# Altium project BMS_Slave_R2.PrjPcb
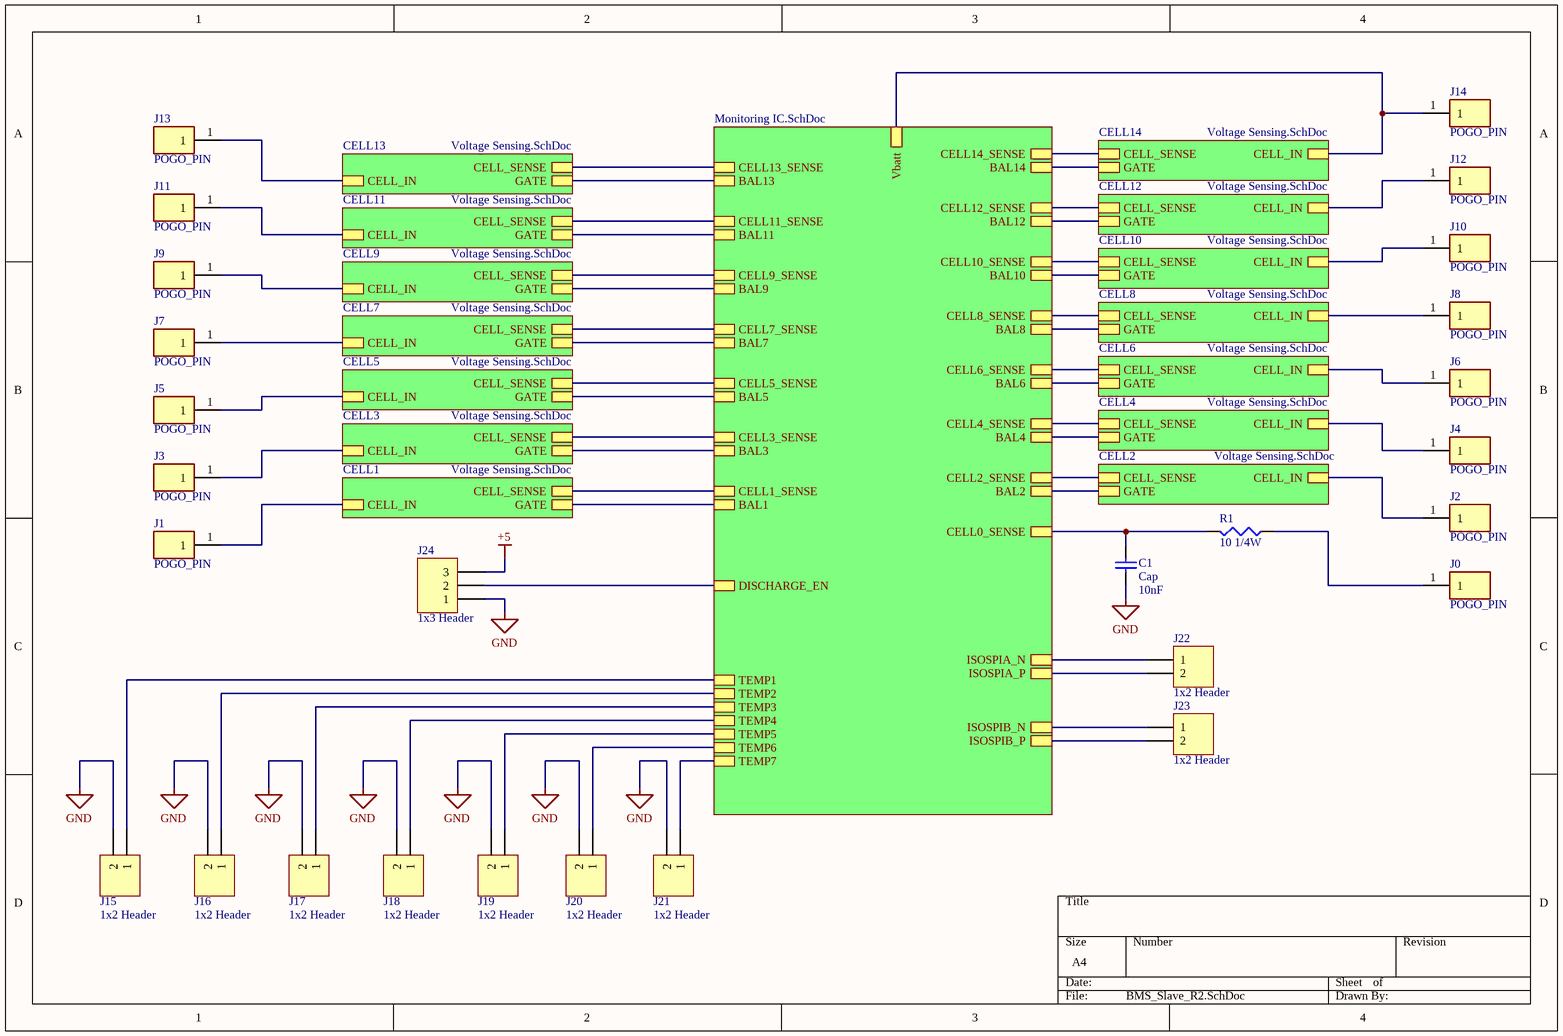
[diagram p0: BMS_Slave_R2.SchDoc]
3 sheets, 120 parts. Net scope: hierarchical (ports join the sheet entries above them; power ports are global).
Board file: BMS_Slave_R2.PcbDoc
Sheets:
  BMS_Slave_R2.SchDoc
    Designator = Monitoring IC.SchDoc
    CELL14 = Voltage Sensing.SchDoc
    CELL12 = Voltage Sensing.SchDoc
    CELL10 = Voltage Sensing.SchDoc
    CELL8 = Voltage Sensing.SchDoc
    CELL6 = Voltage Sensing.SchDoc
    CELL4 = Voltage Sensing.SchDoc
    CELL2 = Voltage Sensing.SchDoc
    CELL13 = Voltage Sensing.SchDoc
    CELL11 = Voltage Sensing.SchDoc
    CELL9 = Voltage Sensing.SchDoc
    CELL7 = Voltage Sensing.SchDoc
    CELL5 = Voltage Sensing.SchDoc
    CELL3 = Voltage Sensing.SchDoc
    CELL1 = Voltage Sensing.SchDoc

## Sheet BMS_Slave_R2.SchDoc
size A4

### Parts
C1  Cap  value 10nF  [0603 - Capacitor]
J0  POGO_PIN  [POGO_PIN]
J1  POGO_PIN  [POGO_PIN]
J2  POGO_PIN  [POGO_PIN]
J3  POGO_PIN  [POGO_PIN]
J4  POGO_PIN  [POGO_PIN]
J5  POGO_PIN  [POGO_PIN]
J6  POGO_PIN  [POGO_PIN]
J7  POGO_PIN  [POGO_PIN]
J8  POGO_PIN  [POGO_PIN]
J9  POGO_PIN  [POGO_PIN]
J10  POGO_PIN  [POGO_PIN]
J11  POGO_PIN  [POGO_PIN]
J12  POGO_PIN  [POGO_PIN]
J13  POGO_PIN  [POGO_PIN]
J14  POGO_PIN  [POGO_PIN]
J15  1x2 Header  [HDR1X2]
J16  1x2 Header  [HDR1X2]
J17  1x2 Header  [HDR1X2]
J18  1x2 Header  [HDR1X2]
J19  1x2 Header  [HDR1X2]
J20  1x2 Header  [HDR1X2]
J21  1x2 Header  [HDR1X2]
J22  1x2 Header  [B2BXH2LFSN]
J23  1x2 Header  [B2BXH2LFSN]
J24  1x3 Header  [HDR1X3]
R1  value 10 1/4W  [0805 - Resistor]  (hidden comment: Res3)

### Sub-sheets
CELL1 = Voltage Sensing.SchDoc: CELL_SENSE, CELL_IN, GATE
CELL2 = Voltage Sensing.SchDoc: CELL_SENSE, CELL_IN, GATE
CELL3 = Voltage Sensing.SchDoc: CELL_SENSE, CELL_IN, GATE
CELL4 = Voltage Sensing.SchDoc: CELL_SENSE, CELL_IN, GATE
CELL5 = Voltage Sensing.SchDoc: CELL_SENSE, CELL_IN, GATE
CELL6 = Voltage Sensing.SchDoc: CELL_SENSE, CELL_IN, GATE
CELL7 = Voltage Sensing.SchDoc: CELL_SENSE, CELL_IN, GATE
CELL8 = Voltage Sensing.SchDoc: CELL_SENSE, CELL_IN, GATE
CELL9 = Voltage Sensing.SchDoc: CELL_SENSE, CELL_IN, GATE
CELL10 = Voltage Sensing.SchDoc: CELL_SENSE, CELL_IN, GATE
CELL11 = Voltage Sensing.SchDoc: CELL_SENSE, CELL_IN, GATE
CELL12 = Voltage Sensing.SchDoc: CELL_SENSE, CELL_IN, GATE
CELL13 = Voltage Sensing.SchDoc: CELL_SENSE, CELL_IN, GATE
CELL14 = Voltage Sensing.SchDoc: CELL_SENSE, CELL_IN, GATE
Designator = Monitoring IC.SchDoc: CELL14_SENSE, BAL14, CELL13_SENSE, BAL13, CELL12_SENSE, BAL12, CELL11_SENSE, BAL11, CELL10_SENSE, BAL10, CELL9_SENSE, BAL9, CELL8_SENSE, BAL8, CELL7_SENSE, BAL7, CELL6_SENSE, BAL6, CELL5_SENSE, BAL5, CELL4_SENSE, BAL4, CELL3_SENSE, BAL3, BAL2, CELL2_SENSE, CELL1_SENSE, BAL1, TEMP3, TEMP4, TEMP2, TEMP1, TEMP5, CELL0_SENSE, DISCHARGE_EN, ISOSPIA_N, ISOSPIB_P, ISOSPIB_N, ISOSPIA_P, Vbatt, TEMP6, TEMP7

### Nets
+5: J24.3
GND: C1.1 J15.2 J16.2 J17.2 J18.2 J19.2 J20.2 J21.2 J24.1
ISOSPIA_N: J22.1 ; sheet Designator/ISOSPIA_N
ISOSPIA_P: J22.2 ; sheet Designator/ISOSPIA_P
ISOSPIB_N: J23.1 ; sheet Designator/ISOSPIB_N
ISOSPIB_P: J23.2 ; sheet Designator/ISOSPIB_P
NetC1_2: C1.2 R1.1 ; sheet Designator/CELL0_SENSE
NetC5#2_2: sheet Designator/CELL14_SENSE, sheet CELL14/CELL_SENSE
NetC5#3_2: sheet Designator/CELL12_SENSE, sheet CELL12/CELL_SENSE
NetC5#4_2: sheet Designator/CELL10_SENSE, sheet CELL10/CELL_SENSE
NetC5#5_2: sheet Designator/CELL8_SENSE, sheet CELL8/CELL_SENSE
NetC5#6_2: sheet Designator/CELL6_SENSE, sheet CELL6/CELL_SENSE
NetC5#7_2: sheet Designator/CELL4_SENSE, sheet CELL4/CELL_SENSE
NetC5#8_2: sheet Designator/CELL2_SENSE, sheet CELL2/CELL_SENSE
NetC5#9_2: sheet Designator/CELL13_SENSE, sheet CELL13/CELL_SENSE
NetC5#10_2: sheet Designator/CELL11_SENSE, sheet CELL11/CELL_SENSE
NetC5#11_2: sheet Designator/CELL9_SENSE, sheet CELL9/CELL_SENSE
NetC5#12_2: sheet Designator/CELL7_SENSE, sheet CELL7/CELL_SENSE
NetC5#13_2: sheet Designator/CELL5_SENSE, sheet CELL5/CELL_SENSE
NetC5#14_2: sheet Designator/CELL3_SENSE, sheet CELL3/CELL_SENSE
NetC5#15_2: sheet Designator/CELL1_SENSE, sheet CELL1/CELL_SENSE
NetD2#1_2: sheet Designator/BAL14, sheet CELL14/GATE
NetD2#2_2: sheet Designator/BAL12, sheet CELL12/GATE
NetD2#3_2: sheet Designator/BAL10, sheet CELL10/GATE
NetD2#4_2: sheet Designator/BAL8, sheet CELL8/GATE
NetD2#5_2: sheet Designator/BAL6, sheet CELL6/GATE
NetD2#6_2: sheet Designator/BAL4, sheet CELL4/GATE
NetD2#7_2: sheet Designator/BAL2, sheet CELL2/GATE
NetD2#8_2: sheet Designator/BAL13, sheet CELL13/GATE
NetD2#9_2: sheet Designator/BAL11, sheet CELL11/GATE
NetD2#10_2: sheet Designator/BAL9, sheet CELL9/GATE
NetD2#11_2: sheet Designator/BAL7, sheet CELL7/GATE
NetD2#12_2: sheet Designator/BAL5, sheet CELL5/GATE
NetD2#13_2: sheet Designator/BAL3, sheet CELL3/GATE
NetD2#14_2: sheet Designator/BAL1, sheet CELL1/GATE
NetJ0_1: J0.1 R1.2
NetJ1_1: J1.1 ; sheet CELL1/CELL_IN
NetJ2_1: J2.1 ; sheet CELL2/CELL_IN
NetJ3_1: J3.1 ; sheet CELL3/CELL_IN
NetJ4_1: J4.1 ; sheet CELL4/CELL_IN
NetJ5_1: J5.1 ; sheet CELL5/CELL_IN
NetJ6_1: J6.1 ; sheet CELL6/CELL_IN
NetJ7_1: J7.1 ; sheet CELL7/CELL_IN
NetJ8_1: J8.1 ; sheet CELL8/CELL_IN
NetJ9_1: J9.1 ; sheet CELL9/CELL_IN
NetJ10_1: J10.1 ; sheet CELL10/CELL_IN
NetJ11_1: J11.1 ; sheet CELL11/CELL_IN
NetJ12_1: J12.1 ; sheet CELL12/CELL_IN
NetJ13_1: J13.1 ; sheet CELL13/CELL_IN
NetJ14_1: J14.1 ; sheet Designator/Vbatt, sheet CELL14/CELL_IN
NetJ15_1: J15.1 ; sheet Designator/TEMP1
NetJ16_1: J16.1 ; sheet Designator/TEMP2
NetJ17_1: J17.1 ; sheet Designator/TEMP3
NetJ18_1: J18.1 ; sheet Designator/TEMP4
NetJ19_1: J19.1 ; sheet Designator/TEMP5
NetJ20_1: J20.1 ; sheet Designator/TEMP6
NetJ21_1: J21.1 ; sheet Designator/TEMP7
NetJ24_2: J24.2 ; sheet Designator/DISCHARGE_EN

### Library data of the parts
C1 = Cap: Capacitor; Published: 8-Jun-2000; LatestRevisionDate: 17-Jul-2002; LatestRevisionNote: Re-released for DXP Platform.; PackageReference: RAD-0.3; Publisher: Altium Limited; PackageDescription: Radial Cap, Thru-Hole; 2 Leads; 0.3 in Pin Spacing
J0-J14 = POGO_PIN: Pogo Pin
J15-J23 = 1x2 Header: 1x2 Pin Header
J24 = 1x3 Header: 1x3 Pin Header
R1 = Res3: Resistor; Published: 8-Jun-2000; LatestRevisionDate: 29-May-2009; LatestRevisionNote: IPC-7351 Footprint Added.; PackageReference: J1-0603; Publisher: Altium Limited; PackageDescription: Chip Resistor

## Sheet Monitoring IC.SchDoc
size A4
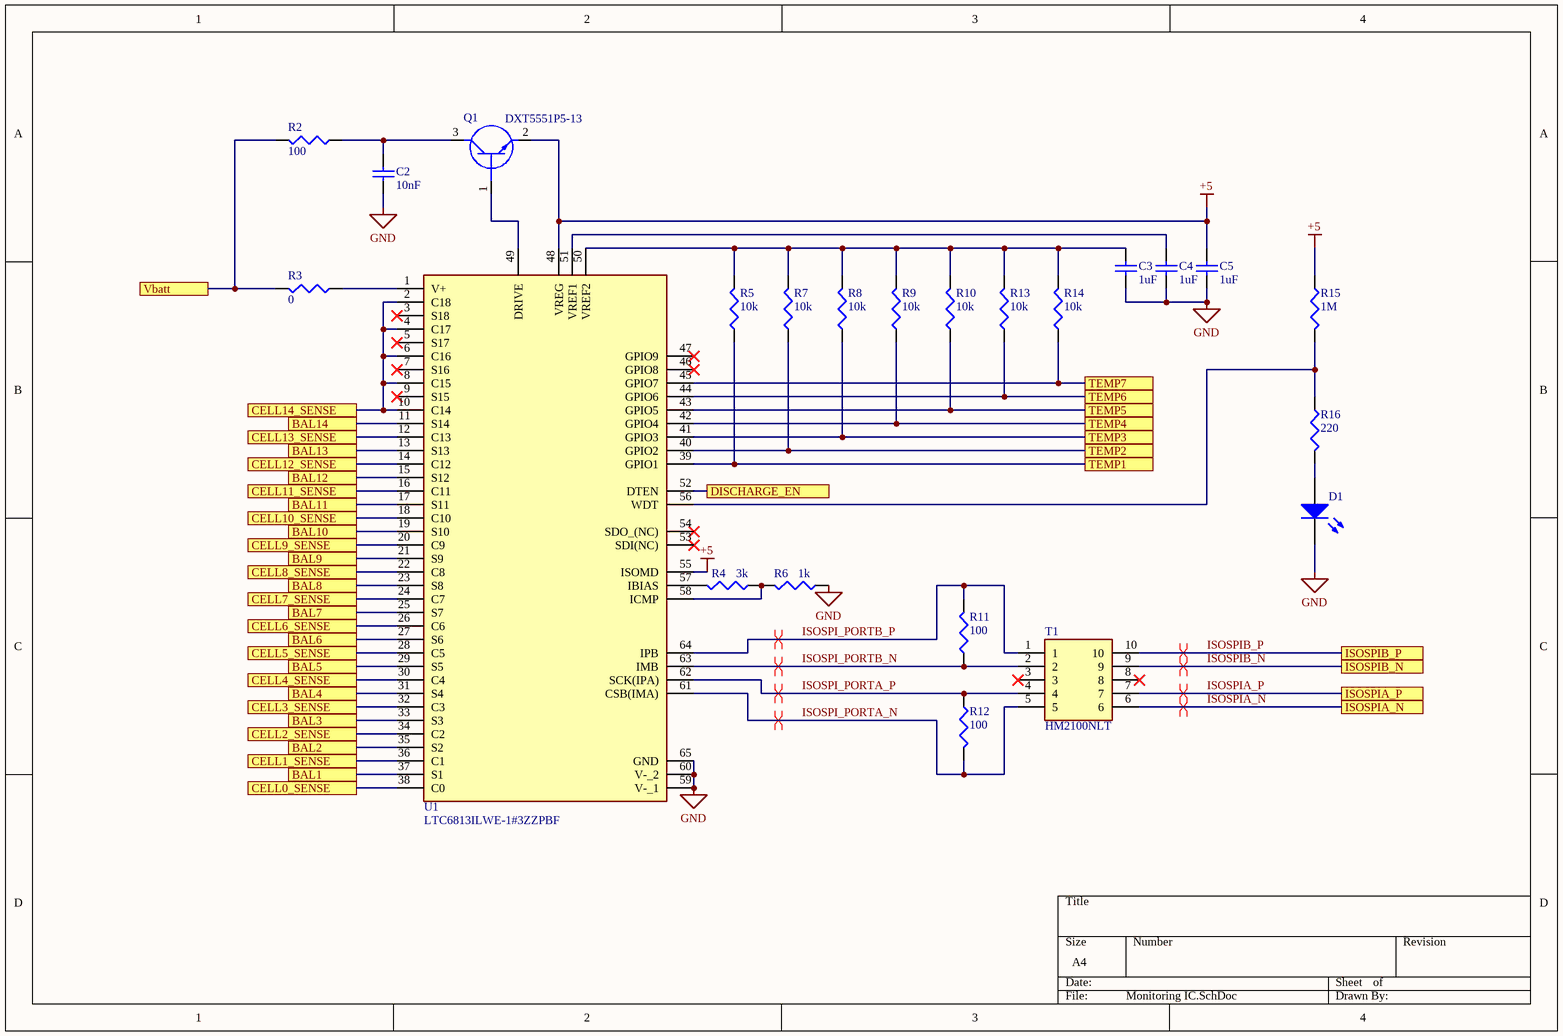
[diagram p1: Monitoring IC.SchDoc]

### Parts
(Parts that share a designator on the sheet are numbered #1, #2 ... from top to bottom, then left to right.)
C2  value 10nF  [0603 - Capacitor]  (hidden comment: Cap)
C3  value 1uF  [0603 - Capacitor]  (hidden comment: Cap)
C4  value 1uF  [0603 - Capacitor]  (hidden comment: Cap)
C5#1  value 1uF  [0603 - Capacitor]  (hidden comment: Cap)
D1  LED2  [DIOC1608X06N]  (value not drawn)
Q1  DXT5551P5-13  [DXT5551P513]
R2  value 100  [0603 - Resistor]  (hidden comment: Res3)
R3  value 0  [0603 - Resistor]  (hidden comment: Res3)
R4  value 3k  [0603 - Resistor]  (hidden comment: Res3)
R5  value 10k  [0603 - Resistor]  (hidden comment: Res3)
R6  value 1k  [0603 - Resistor]  (hidden comment: Res3)
R7  value 10k  [0603 - Resistor]  (hidden comment: Res3)
R8  value 10k  [0603 - Resistor]  (hidden comment: Res3)
R9  value 10k  [0603 - Resistor]  (hidden comment: Res3)
R10  value 10k  [0603 - Resistor]  (hidden comment: Res3)
R11  value 100  [0603 - Resistor]  (hidden comment: Res3)
R12  value 100  [0603 - Resistor]  (hidden comment: Res3)
R13  value 10k  [0603 - Resistor]  (hidden comment: Res3)
R14  value 10k  [0603 - Resistor]  (hidden comment: Res3)
R15#1  value 1M  [0603 - Resistor]  (hidden comment: Res3)
R16#1  value 220  [0603 - Resistor]  (hidden comment: Res3)
T1  HM2100NLT  [HM2100NLT]
U1  LTC6813ILWE-1#3ZZPBF  [QFP50P1200X1200X120-65N]

### Ports
BAL1, BAL2, BAL3, BAL4, BAL5, BAL6, BAL7, BAL8, BAL9, BAL10, BAL11, BAL12, BAL13, BAL14, CELL0_SENSE, CELL1_SENSE, CELL2_SENSE, CELL3_SENSE, CELL4_SENSE, CELL5_SENSE, CELL6_SENSE, CELL7_SENSE, CELL8_SENSE, CELL9_SENSE, CELL10_SENSE, CELL11_SENSE, CELL12_SENSE, CELL13_SENSE, CELL14_SENSE, DISCHARGE_EN, ISOSPIA_N, ISOSPIA_P, ISOSPIB_N, ISOSPIB_P, TEMP1, TEMP2, TEMP3, TEMP4, TEMP5, TEMP6, TEMP7, Vbatt

### Nets
+5: C5#1.2 Q1.2(E) R15#1.1 U1.48(VREG) U1.55(ISOMD)
GND: C2.1 C3.1 C4.1 C5#1.1 D1.2(K) R6.1 U1.59(V-_1) U1.60(V-_2) U1.65(GND)
ISOSPI_PORTA_N: R12.2 T1.5 U1.61(CSB(IMA))
ISOSPI_PORTA_P: R12.1 T1.4 U1.62(SCK(IPA))
ISOSPI_PORTB_N: R11.1 T1.2 U1.63(IMB)
ISOSPI_PORTB_P: R11.2 T1.1 U1.64(IPB)
ISOSPIA_N: T1.6 ; port ISOSPIA_N
ISOSPIA_P: T1.7 ; port ISOSPIA_P
ISOSPIB_N: T1.9 ; port ISOSPIB_N
ISOSPIB_P: T1.10 ; port ISOSPIB_P
NetC1_2: U1.38(C0) ; port CELL0_SENSE
NetC2_2: C2.2 Q1.3(C) R2.2
NetC3_2: C3.2 R5.2 R7.2 R8.2 R9.2 R10.2 R13.2 R14.2 U1.50(VREF2)
NetC4_2: C4.2 U1.51(VREF1)
NetC5#2_2: U1.2(C18) U1.4(C17) U1.6(C16) U1.8(C15) U1.10(C14) ; port CELL14_SENSE
NetC5#3_2: U1.14(C12) ; port CELL12_SENSE
NetC5#4_2: U1.18(C10) ; port CELL10_SENSE
NetC5#5_2: U1.22(C8) ; port CELL8_SENSE
NetC5#6_2: U1.26(C6) ; port CELL6_SENSE
NetC5#7_2: U1.30(C4) ; port CELL4_SENSE
NetC5#8_2: U1.34(C2) ; port CELL2_SENSE
NetC5#9_2: U1.12(C13) ; port CELL13_SENSE
NetC5#10_2: U1.16(C11) ; port CELL11_SENSE
NetC5#11_2: U1.20(C9) ; port CELL9_SENSE
NetC5#12_2: U1.24(C7) ; port CELL7_SENSE
NetC5#13_2: U1.28(C5) ; port CELL5_SENSE
NetC5#14_2: U1.32(C3) ; port CELL3_SENSE
NetC5#15_2: U1.36(C1) ; port CELL1_SENSE
NetD1_1: D1.1(A) R16#1.2
NetD2#1_2: U1.11(S14) ; port BAL14
NetD2#2_2: U1.15(S12) ; port BAL12
NetD2#3_2: U1.19(S10) ; port BAL10
NetD2#4_2: U1.23(S8) ; port BAL8
NetD2#5_2: U1.27(S6) ; port BAL6
NetD2#6_2: U1.31(S4) ; port BAL4
NetD2#7_2: U1.35(S2) ; port BAL2
NetD2#8_2: U1.13(S13) ; port BAL13
NetD2#9_2: U1.17(S11) ; port BAL11
NetD2#10_2: U1.21(S9) ; port BAL9
NetD2#11_2: U1.25(S7) ; port BAL7
NetD2#12_2: U1.29(S5) ; port BAL5
NetD2#13_2: U1.33(S3) ; port BAL3
NetD2#14_2: U1.37(S1) ; port BAL1
NetJ14_1: R2.1 R3.1 ; port Vbatt
NetJ15_1: R5.1 U1.39(GPIO1) ; port TEMP1
NetJ16_1: R7.1 U1.40(GPIO2) ; port TEMP2
NetJ17_1: R8.1 U1.41(GPIO3) ; port TEMP3
NetJ18_1: R9.1 U1.42(GPIO4) ; port TEMP4
NetJ19_1: R10.1 U1.43(GPIO5) ; port TEMP5
NetJ20_1: R13.1 U1.44(GPIO6) ; port TEMP6
NetJ21_1: R14.1 U1.45(GPIO7) ; port TEMP7
NetJ24_2: U1.52(DTEN) ; port DISCHARGE_EN
NetQ1_1: Q1.1(B) U1.49(DRIVE)
NetR3_2: R3.2 U1.1(V+)
NetR4_1: R4.1 R6.2 U1.58(ICMP)
NetR4_2: R4.2 U1.57(IBIAS)
NetR15#1_2: R15#1.2 R16#1.1 U1.56(WDT)

Not connected (* = marked no-connect by the designer): T1 3* 8*; U1 3(S18)* 5(S17)* 7(S16)* 9(S15)* 46(GPIO8)* 47(GPIO9)* 53(SDI(NC))* 54(SDO_(NC))*

### Layout directives
differential pair: ISOSPI_PORTA_N
differential pair; differential pair class ISOSPI_PORTA_N: ISOSPI_PORTA_P, ISOSPI_PORTB_N, ISOSPI_PORTB_P, ISOSPIA_N, ISOSPIA_P, ISOSPIB_N, ISOSPIB_P

### Library data of the parts
C2-C4 C5#1 = Cap: Capacitor; Published: 8-Jun-2000; LatestRevisionDate: 17-Jul-2002; LatestRevisionNote: Re-released for DXP Platform.; PackageReference: RAD-0.3; Publisher: Altium Limited; PackageDescription: Radial Cap, Thru-Hole; 2 Leads; 0.3 in Pin Spacing
D1 = LED2: Typical RED, GREEN, YELLOW, AMBER GaAs LED; Published: 8-Jun-2000; LatestRevisionDate: 17-Jul-2002; LatestRevisionNote: Re-released for DXP Platform.; PackageVersion: Feb-2002; PackageReference: 3.2X1.6X1.1; Publisher: Altium Limited; PackageDescription: SM LED; 2 Flat Leads
Q1 = DXT5551P5-13: Transistor BJT NPN; Manufacturer_Name: Diodes Inc.; Datasheet Link: https://www.diodes.com/assets/Datasheets/DXT5551P5.pdf; Manufacturer_Part_Number: DXT5551P5-13; Mouser Part Number: 522-DXT5551P5-13; Mouser Price/Stock: https://www.mouser.com/Search/Refine.aspx?Keyword=522-DXT5551P5-13
R2-R14 R15#1 R16#1 = Res3: Resistor; Published: 8-Jun-2000; LatestRevisionDate: 29-May-2009; LatestRevisionNote: IPC-7351 Footprint Added.; PackageReference: J1-0603; Publisher: Altium Limited; PackageDescription: Chip Resistor
T1 = HM2100NLT: Transformer; Manufacturer_Name: Pulse; Datasheet Link: https://productfinder.pulseeng.com/doc_type/WEB301/doc_num/HM2100NL/doc_part/HM2100NL.pdf; Height: 3.45mm; Manufacturer_Part_Number: HM2100NLT; Mouser Part Number: 673-HM2100NLT; Mouser Price/Stock: https://www.mouser.com/Search/Refine.aspx?Keyword=673-HM2100NLT
U1 = LTC6813ILWE-1#3ZZPBF: Integrated Circuit; Manufacturer_Name: Analog Devices; Datasheet Link: https://www.analog.com/media/en/technical-documentation/data-sheets/68131f.pdf; Height: 1.6mm; Manufacturer_Part_Number: LTC6813ILWE-1#3ZZPBF; Mouser Part Number: 584-6813ILWE13ZZPBF

## Sheet Voltage Sensing.SchDoc
size A4
Used 14 times, as channels CELL14, CELL12, CELL10, CELL8, CELL6, CELL4, CELL2, CELL13, CELL11, CELL9, CELL7, CELL5, CELL3, CELL1. Parts and nets are listed once, with the designators drawn on the sheet.
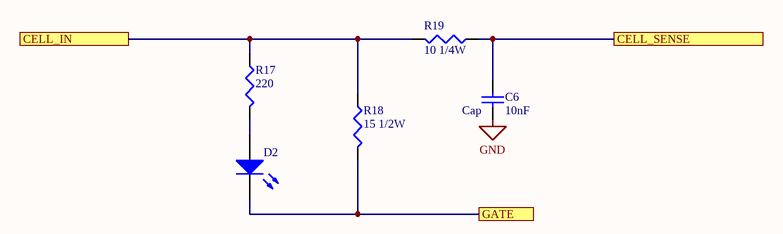
[diagram p2: Voltage Sensing.SchDoc]

### Parts
C6  Cap  value 10nF  [0603 - Capacitor]
D2  LED2  [DIOC1608X06N]  (value not drawn)
R17  value 220  [0805 - Resistor]  (hidden comment: Res3)
R18  value 15 1/2W  [14-1210]  (hidden comment: Res3)
R19  value 10 1/4W  [0805 - Resistor]  (hidden comment: Res3)

### Ports
CELL_IN, CELL_SENSE, GATE

### Nets
GND: C6.1
CELL_IN: R17.1 R18.1 R19.2 ; port CELL_IN
CELL_SENSE: C6.2 R19.1 ; port CELL_SENSE
GATE: D2.2(K) R18.2 ; port GATE
NetD2_1: D2.1(A) R17.2

### Channels
CELL14: designators C6=C5#2 D2=D2#1 R17=R15#2 R18=R16#2 R19=R17#1; ports CELL_IN=NetJ14_1 CELL_SENSE=NetC5#2_2 GATE=NetD2#1_2
CELL12: designators C6=C5#3 D2=D2#2 R17=R15#3 R18=R16#3 R19=R17#2; ports CELL_IN=NetJ12_1 CELL_SENSE=NetC5#3_2 GATE=NetD2#2_2
CELL10: designators C6=C5#4 D2=D2#3 R17=R15#4 R18=R16#4 R19=R17#3; ports CELL_IN=NetJ10_1 CELL_SENSE=NetC5#4_2 GATE=NetD2#3_2
CELL8: designators C6=C5#5 D2=D2#4 R17=R15#5 R18=R16#5 R19=R17#4; ports CELL_IN=NetJ8_1 CELL_SENSE=NetC5#5_2 GATE=NetD2#4_2
CELL6: designators C6=C5#6 D2=D2#5 R17=R15#6 R18=R16#6 R19=R17#5; ports CELL_IN=NetJ6_1 CELL_SENSE=NetC5#6_2 GATE=NetD2#5_2
CELL4: designators C6=C5#7 D2=D2#6 R17=R15#7 R18=R16#7 R19=R17#6; ports CELL_IN=NetJ4_1 CELL_SENSE=NetC5#7_2 GATE=NetD2#6_2
CELL2: designators C6=C5#8 D2=D2#7 R17=R15#8 R18=R16#8 R19=R17#7; ports CELL_IN=NetJ2_1 CELL_SENSE=NetC5#8_2 GATE=NetD2#7_2
CELL13: designators C6=C5#9 D2=D2#8 R17=R15#9 R18=R16#9 R19=R17#8; ports CELL_IN=NetJ13_1 CELL_SENSE=NetC5#9_2 GATE=NetD2#8_2
CELL11: designators C6=C5#10 D2=D2#9 R17=R15#10 R18=R16#10 R19=R17#9; ports CELL_IN=NetJ11_1 CELL_SENSE=NetC5#10_2 GATE=NetD2#9_2
CELL9: designators C6=C5#11 D2=D2#10 R17=R15#11 R18=R16#11 R19=R17#10; ports CELL_IN=NetJ9_1 CELL_SENSE=NetC5#11_2 GATE=NetD2#10_2
CELL7: designators C6=C5#12 D2=D2#11 R17=R15#12 R18=R16#12 R19=R17#11; ports CELL_IN=NetJ7_1 CELL_SENSE=NetC5#12_2 GATE=NetD2#11_2
CELL5: designators C6=C5#13 D2=D2#12 R17=R15#13 R18=R16#13 R19=R17#12; ports CELL_IN=NetJ5_1 CELL_SENSE=NetC5#13_2 GATE=NetD2#12_2
CELL3: designators C6=C5#14 D2=D2#13 R17=R15#14 R18=R16#14 R19=R17#13; ports CELL_IN=NetJ3_1 CELL_SENSE=NetC5#14_2 GATE=NetD2#13_2
CELL1: designators C6=C5#15 D2=D2#14 R17=R15#15 R18=R16#15 R19=R17#14; ports CELL_IN=NetJ1_1 CELL_SENSE=NetC5#15_2 GATE=NetD2#14_2

### Library data of the parts
C6 = Cap: Capacitor; Published: 8-Jun-2000; LatestRevisionDate: 17-Jul-2002; LatestRevisionNote: Re-released for DXP Platform.; PackageReference: RAD-0.3; Publisher: Altium Limited; PackageDescription: Radial Cap, Thru-Hole; 2 Leads; 0.3 in Pin Spacing
D2 = LED2: as D1 on sheet Monitoring IC; Published: 8-Jun-2000; LatestRevisionDate: 17-Jul-2002; LatestRevisionNote: Re-released for DXP Platform.; PackageVersion: Feb-2002; PackageReference: 3.2X1.6X1.1; Publisher: Altium Limited; PackageDescription: SM LED; 2 Flat Leads
R17-R19 = Res3: Resistor; Published: 8-Jun-2000; LatestRevisionDate: 29-May-2009; LatestRevisionNote: IPC-7351 Footprint Added.; PackageReference: J1-0603; Publisher: Altium Limited; PackageDescription: Chip Resistor

## Nets that join several sheets
+5: BMS_Slave_R2 (J24.3), Monitoring IC (5 pins)
GND: BMS_Slave_R2 (9 pins), Monitoring IC (9 pins), CELL14 (C5#2.1), CELL12 (C5#3.1), CELL10 (C5#4.1), CELL8 (C5#5.1), CELL6 (C5#6.1), CELL4 (C5#7.1), CELL2 (C5#8.1), CELL13 (C5#9.1), CELL11 (C5#10.1), CELL9 (C5#11.1), CELL7 (C5#12.1), CELL5 (C5#13.1), CELL3 (C5#14.1), CELL1 (C5#15.1)
ISOSPIA_N: BMS_Slave_R2 (J22.1), Monitoring IC (T1.6)
ISOSPIA_P: BMS_Slave_R2 (J22.2), Monitoring IC (T1.7)
ISOSPIB_N: BMS_Slave_R2 (J23.1), Monitoring IC (T1.9)
ISOSPIB_P: BMS_Slave_R2 (J23.2), Monitoring IC (T1.10)
NetC1_2: BMS_Slave_R2 (C1.2 R1.1), Monitoring IC (U1.38)
NetC5#2_2: Monitoring IC (5 pins), CELL14 (C5#2.2 R17#1.1)
NetC5#3_2: Monitoring IC (U1.14), CELL12 (C5#3.2 R17#2.1)
NetC5#4_2: Monitoring IC (U1.18), CELL10 (C5#4.2 R17#3.1)
NetC5#5_2: Monitoring IC (U1.22), CELL8 (C5#5.2 R17#4.1)
NetC5#6_2: Monitoring IC (U1.26), CELL6 (C5#6.2 R17#5.1)
NetC5#7_2: Monitoring IC (U1.30), CELL4 (C5#7.2 R17#6.1)
NetC5#8_2: Monitoring IC (U1.34), CELL2 (C5#8.2 R17#7.1)
NetC5#9_2: Monitoring IC (U1.12), CELL13 (C5#9.2 R17#8.1)
NetC5#10_2: Monitoring IC (U1.16), CELL11 (C5#10.2 R17#9.1)
NetC5#11_2: Monitoring IC (U1.20), CELL9 (C5#11.2 R17#10.1)
NetC5#12_2: Monitoring IC (U1.24), CELL7 (C5#12.2 R17#11.1)
NetC5#13_2: Monitoring IC (U1.28), CELL5 (C5#13.2 R17#12.1)
NetC5#14_2: Monitoring IC (U1.32), CELL3 (C5#14.2 R17#13.1)
NetC5#15_2: Monitoring IC (U1.36), CELL1 (C5#15.2 R17#14.1)
NetD2#1_2: Monitoring IC (U1.11), CELL14 (D2#1.2 R16#2.2)
NetD2#2_2: Monitoring IC (U1.15), CELL12 (D2#2.2 R16#3.2)
NetD2#3_2: Monitoring IC (U1.19), CELL10 (D2#3.2 R16#4.2)
NetD2#4_2: Monitoring IC (U1.23), CELL8 (D2#4.2 R16#5.2)
NetD2#5_2: Monitoring IC (U1.27), CELL6 (D2#5.2 R16#6.2)
NetD2#6_2: Monitoring IC (U1.31), CELL4 (D2#6.2 R16#7.2)
NetD2#7_2: Monitoring IC (U1.35), CELL2 (D2#7.2 R16#8.2)
NetD2#8_2: Monitoring IC (U1.13), CELL13 (D2#8.2 R16#9.2)
NetD2#9_2: Monitoring IC (U1.17), CELL11 (D2#9.2 R16#10.2)
NetD2#10_2: Monitoring IC (U1.21), CELL9 (D2#10.2 R16#11.2)
NetD2#11_2: Monitoring IC (U1.25), CELL7 (D2#11.2 R16#12.2)
NetD2#12_2: Monitoring IC (U1.29), CELL5 (D2#12.2 R16#13.2)
NetD2#13_2: Monitoring IC (U1.33), CELL3 (D2#13.2 R16#14.2)
NetD2#14_2: Monitoring IC (U1.37), CELL1 (D2#14.2 R16#15.2)
NetJ1_1: BMS_Slave_R2 (J1.1), CELL1 (R15#15.1 R16#15.1 R17#14.2)
NetJ2_1: BMS_Slave_R2 (J2.1), CELL2 (R15#8.1 R16#8.1 R17#7.2)
NetJ3_1: BMS_Slave_R2 (J3.1), CELL3 (R15#14.1 R16#14.1 R17#13.2)
NetJ4_1: BMS_Slave_R2 (J4.1), CELL4 (R15#7.1 R16#7.1 R17#6.2)
NetJ5_1: BMS_Slave_R2 (J5.1), CELL5 (R15#13.1 R16#13.1 R17#12.2)
NetJ6_1: BMS_Slave_R2 (J6.1), CELL6 (R15#6.1 R16#6.1 R17#5.2)
NetJ7_1: BMS_Slave_R2 (J7.1), CELL7 (R15#12.1 R16#12.1 R17#11.2)
NetJ8_1: BMS_Slave_R2 (J8.1), CELL8 (R15#5.1 R16#5.1 R17#4.2)
NetJ9_1: BMS_Slave_R2 (J9.1), CELL9 (R15#11.1 R16#11.1 R17#10.2)
NetJ10_1: BMS_Slave_R2 (J10.1), CELL10 (R15#4.1 R16#4.1 R17#3.2)
NetJ11_1: BMS_Slave_R2 (J11.1), CELL11 (R15#10.1 R16#10.1 R17#9.2)
NetJ12_1: BMS_Slave_R2 (J12.1), CELL12 (R15#3.1 R16#3.1 R17#2.2)
NetJ13_1: BMS_Slave_R2 (J13.1), CELL13 (R15#9.1 R16#9.1 R17#8.2)
NetJ14_1: BMS_Slave_R2 (J14.1), Monitoring IC (R2.1 R3.1), CELL14 (R15#2.1 R16#2.1 R17#1.2)
NetJ15_1: BMS_Slave_R2 (J15.1), Monitoring IC (R5.1 U1.39)
NetJ16_1: BMS_Slave_R2 (J16.1), Monitoring IC (R7.1 U1.40)
NetJ17_1: BMS_Slave_R2 (J17.1), Monitoring IC (R8.1 U1.41)
NetJ18_1: BMS_Slave_R2 (J18.1), Monitoring IC (R9.1 U1.42)
NetJ19_1: BMS_Slave_R2 (J19.1), Monitoring IC (R10.1 U1.43)
NetJ20_1: BMS_Slave_R2 (J20.1), Monitoring IC (R13.1 U1.44)
NetJ21_1: BMS_Slave_R2 (J21.1), Monitoring IC (R14.1 U1.45)
NetJ24_2: BMS_Slave_R2 (J24.2), Monitoring IC (U1.52)